# Altium project fmuvxX-baseT1.PrjPCB (part 2 of 3)

## Sheet 05_can_spi.SchDoc: =Proj_Title
size B; Date: 05/11/2022; CheckedBy: David Sidrane; Author: Dugan Yoon; Organization: © 2022 NXP; Address1: Giesshuebelstrasse 40; Address2: 8045 Zurich, Switzerland; DocumentNumber: 725001; Revision: 01; SheetNumber: 5; SheetTotal: 11
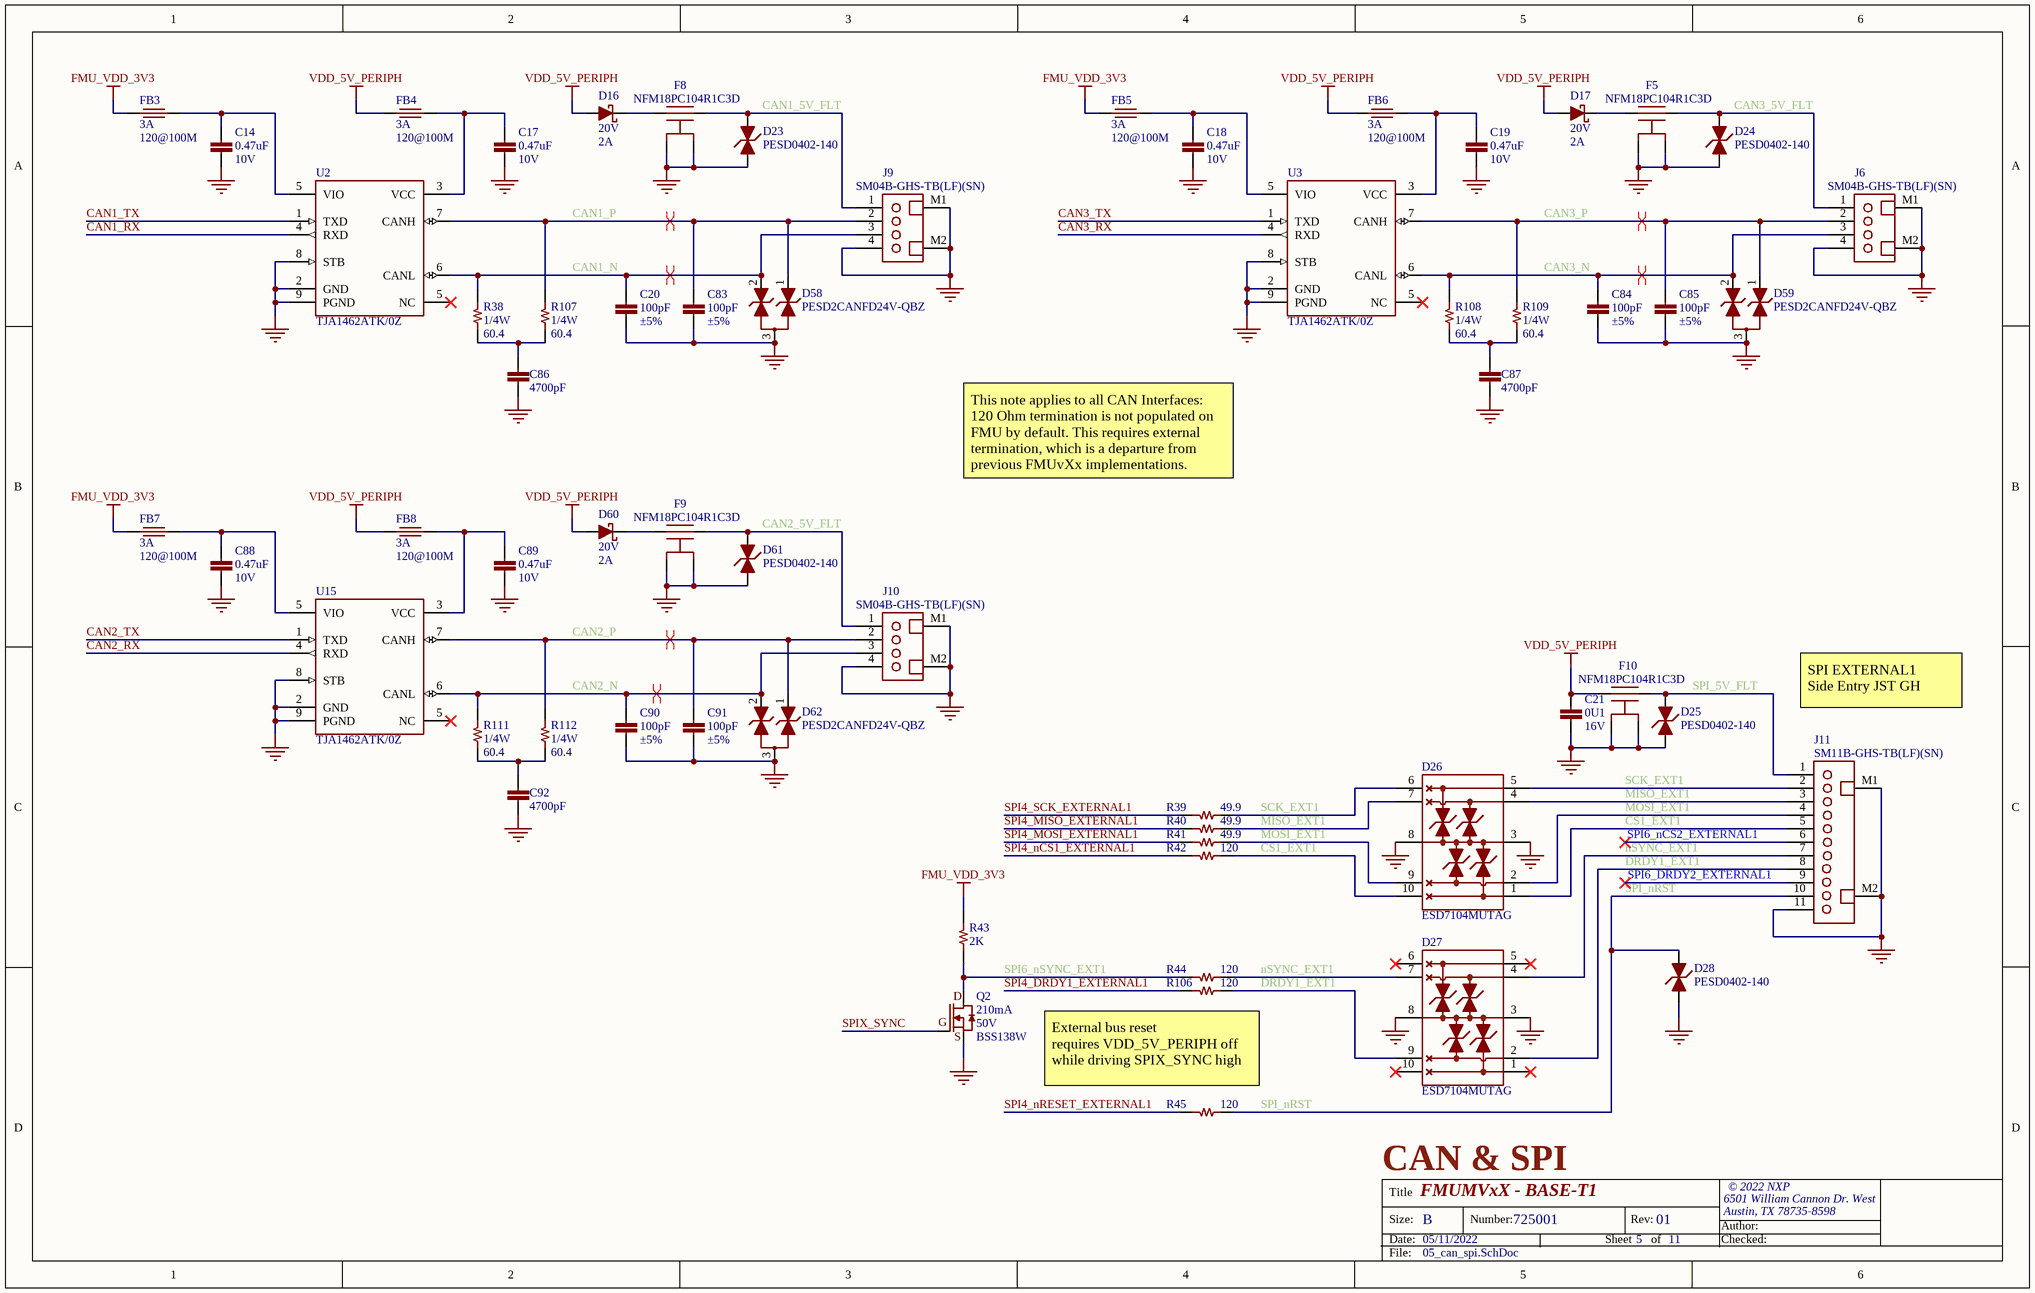
[diagram p3: 05_can_spi.SchDoc]

### Parts
C14  value 0.47uF  Voltage - Rated: 10V  [CAPC1608X90L30N]  (hidden comment: CAP CER 0.47UF 10% 10V X7R 0603)
C17  value 0.47uF  Voltage - Rated: 10V  [CAPC1608X90L30N]  (hidden comment: CAP CER 0.47UF 10% 10V X7R 0603)
C18  value 0.47uF  Voltage - Rated: 10V  [CAPC1608X90L30N]  (hidden comment: CAP CER 0.47UF 10% 10V X7R 0603)
C19  value 0.47uF  Voltage - Rated: 10V  [CAPC1608X90L30N]  (hidden comment: CAP CER 0.47UF 10% 10V X7R 0603)
C20  value 100pF  Tolerance: ±5%  [CAPC100X50X56L25N]  (hidden comment: CAP CER 100PF +/-5% 50V COG/NPO 0402)
C21  value 0U1  Voltage - Rated: 16V  [CAPC100X50X56L25N]  (hidden comment: CAP CER 0.1UF 10% 16V X7R 0402)
C83  value 100pF  Tolerance: ±5%  [CAPC100X50X56L25N]  (hidden comment: CAP CER 100PF +/-5% 50V COG/NPO 0402)
C84  value 100pF  Tolerance: ±5%  [CAPC100X50X56L25N]  (hidden comment: CAP CER 100PF +/-5% 50V COG/NPO 0402)
C85  value 100pF  Tolerance: ±5%  [CAPC100X50X56L25N]  (hidden comment: CAP CER 100PF +/-5% 50V COG/NPO 0402)
C86  value 4700pF  [CAPC100X50X56L25N]  (hidden comment: CAP CER 4700PF 10% 50V X7R 0402)
C87  value 4700pF  [CAPC100X50X56L25N]  (hidden comment: CAP CER 4700PF 10% 50V X7R 0402)
C88  value 0.47uF  Voltage - Rated: 10V  [CAPC1608X90L30N]  (hidden comment: CAP CER 0.47UF 10% 10V X7R 0603)
C89  value 0.47uF  Voltage - Rated: 10V  [CAPC1608X90L30N]  (hidden comment: CAP CER 0.47UF 10% 10V X7R 0603)
C90  value 100pF  Tolerance: ±5%  [CAPC100X50X56L25N]  (hidden comment: CAP CER 100PF +/-5% 50V COG/NPO 0402)
C91  value 100pF  Tolerance: ±5%  [CAPC100X50X56L25N]  (hidden comment: CAP CER 100PF +/-5% 50V COG/NPO 0402)
C92  value 4700pF  [CAPC100X50X56L25N]  (hidden comment: CAP CER 4700PF 10% 50V X7R 0402)
D16  Voltage: 20V  Current: 2A  [DIODFN2_160X80X40L34X71N]  (hidden comment: DIODE SCHOTTKY 20V 2A DFN1608D-2)
D17  Voltage: 20V  Current: 2A  [DIODFN2_160X80X40L34X71N]  (hidden comment: DIODE SCHOTTKY 20V 2A DFN1608D-2)
D23  Manufacturer Part Number: PESD0402-140  [DIONC100X50X43L20N]  (hidden comment: DIODE TVS BIDIRECTIONAL 14VWM 40VC 0402)
D24  Manufacturer Part Number: PESD0402-140  [DIONC100X50X43L20N]  (hidden comment: DIODE TVS BIDIRECTIONAL 14VWM 40VC 0402)
D25  Manufacturer Part Number: PESD0402-140  [DIONC100X50X43L20N]  (hidden comment: DIODE TVS BIDIRECTIONAL 14VWM 40VC 0402)
D26  Manufacturer Part Number: ESD7104MUTAG  [UDFN10P50_250X100X55L35X20N]  (hidden comment: DIODE TVS BIDIRECTIONAL 5V 10V 10UDFN)
D27  Manufacturer Part Number: ESD7104MUTAG  [UDFN10P50_250X100X55L35X20N]  (hidden comment: DIODE TVS BIDIRECTIONAL 5V 10V 10UDFN)
D28  Manufacturer Part Number: PESD0402-140  [DIONC100X50X43L20N]  (hidden comment: DIODE TVS BIDIRECTIONAL 14VWM 40VC 0402)
D58  Manufacturer Part Number: PESD2CANFD24V-QBZ  [NEXPERIA_SOT8015]  (hidden comment: DIODE TVS DUAL 42V CLAMP 2.6A (8/20us) DFN1110D-3)
D59  Manufacturer Part Number: PESD2CANFD24V-QBZ  [NEXPERIA_SOT8015]  (hidden comment: DIODE TVS DUAL 42V CLAMP 2.6A (8/20us) DFN1110D-3)
D60  Voltage: 20V  Current: 2A  [DIODFN2_160X80X40L34X71N]  (hidden comment: DIODE SCHOTTKY 20V 2A DFN1608D-2)
D61  Manufacturer Part Number: PESD0402-140  [DIONC100X50X43L20N]  (hidden comment: DIODE TVS BIDIRECTIONAL 14VWM 40VC 0402)
D62  Manufacturer Part Number: PESD2CANFD24V-QBZ  [NEXPERIA_SOT8015]  (hidden comment: DIODE TVS DUAL 42V CLAMP 2.6A (8/20us) DFN1110D-3)
F5  Manufacturer Part Number: NFM18PC104R1C3D  [NFM18PC104R1C3_0603_NO_VIA]  (hidden comment: FILTER CAP FEEDTHRU 0.1UF 20% 16V 0603)
F8  Manufacturer Part Number: NFM18PC104R1C3D  [NFM18PC104R1C3_0603_NO_VIA]  (hidden comment: FILTER CAP FEEDTHRU 0.1UF 20% 16V 0603)
F9  Manufacturer Part Number: NFM18PC104R1C3D  [NFM18PC104R1C3_0603_NO_VIA]  (hidden comment: FILTER CAP FEEDTHRU 0.1UF 20% 16V 0603)
F10  Manufacturer Part Number: NFM18PC104R1C3D  [NFM18PC104R1C3_0603_NO_VIA]  (hidden comment: FILTER CAP FEEDTHRU 0.1UF 20% 16V 0603)
FB3  value 120@100M  Current: 3A  [BEADC160X80X95L36N]  (hidden comment: IND FERRITE 120@100M 3A 20mOhm 0603)
FB4  value 120@100M  Current: 3A  [BEADC160X80X95L36N]  (hidden comment: IND FERRITE 120@100M 3A 20mOhm 0603)
FB5  value 120@100M  Current: 3A  [BEADC160X80X95L36N]  (hidden comment: IND FERRITE 120@100M 3A 20mOhm 0603)
FB6  value 120@100M  Current: 3A  [BEADC160X80X95L36N]  (hidden comment: IND FERRITE 120@100M 3A 20mOhm 0603)
FB7  value 120@100M  Current: 3A  [BEADC160X80X95L36N]  (hidden comment: IND FERRITE 120@100M 3A 20mOhm 0603)
FB8  value 120@100M  Current: 3A  [BEADC160X80X95L36N]  (hidden comment: IND FERRITE 120@100M 3A 20mOhm 0603)
J6  Manufacturer Part Number: SM04B-GHS-TB(LF)(SN)  [JST_SM04B-GHS-TBLFSN]  (hidden comment: CONN HEADER GH SIDE 4POS 1.25MM SMT)
J9  Manufacturer Part Number: SM04B-GHS-TB(LF)(SN)  [JST_SM04B-GHS-TBLFSN]  (hidden comment: CONN HEADER GH SIDE 4POS 1.25MM SMT)
J10  Manufacturer Part Number: SM04B-GHS-TB(LF)(SN)  [JST_SM04B-GHS-TBLFSN]  (hidden comment: CONN HEADER GH SIDE 4POS 1.25MM SMT)
J11  Manufacturer Part Number: SM11B-GHS-TB(LF)(SN)  [JST_SM11B-GHS-TBLFSN]  (hidden comment: CONN HEADER GH 11POS SIDE 1.25MM SMT)
Q2  Current: 210mA  Voltage: 50V  Manufacturer Part Number: BSS138W  [OnSemi_SC-70-3P65_210X110L20X32N]  (hidden comment: TRANSISTOR N-CH 50V .21A  SC-70)
R38  value 60.4  Power: 1/4W  [RESC1608X55L30N]  (hidden comment: RES 60.4 1% 1/4W 0603)
R39  value 49.9  [RESC100X50X40L25]  (hidden comment: RES SMD 49R9 OHM 1% 1/16W 0402)
R40  value 49.9  [RESC100X50X40L25]  (hidden comment: RES SMD 49R9 OHM 1% 1/16W 0402)
R41  value 49.9  [RESC100X50X40L25]  (hidden comment: RES SMD 49R9 OHM 1% 1/16W 0402)
R42  value 120  [RESC100X50X40L25]  (hidden comment: RES SMD 120 OHM 1% 1/16W 0402)
R43  value 2K  [RESC100X50X40L25]  (hidden comment: RES SMD 2K OHM 1% 1/16W 0402)
R44  value 120  [RESC100X50X40L25]  (hidden comment: RES SMD 120 OHM 1% 1/16W 0402)
R45  value 120  [RESC100X50X40L25]  (hidden comment: RES SMD 120 OHM 1% 1/16W 0402)
R106  value 120  [RESC100X50X40L25]  (hidden comment: RES SMD 120 OHM 1% 1/16W 0402)
R107  value 60.4  Power: 1/4W  [RESC1608X55L30N]  (hidden comment: RES 60.4 1% 1/4W 0603)
R108  value 60.4  Power: 1/4W  [RESC1608X55L30N]  (hidden comment: RES 60.4 1% 1/4W 0603)
R109  value 60.4  Power: 1/4W  [RESC1608X55L30N]  (hidden comment: RES 60.4 1% 1/4W 0603)
R111  value 60.4  Power: 1/4W  [RESC1608X55L30N]  (hidden comment: RES 60.4 1% 1/4W 0603)
R112  value 60.4  Power: 1/4W  [RESC1608X55L30N]  (hidden comment: RES 60.4 1% 1/4W 0603)
U2  Manufacturer Part Number: TJA1462ATK/0Z  [SON9P65_300X300X100L40X30T240X160_RECT_TABN]  (hidden comment: IC CAN TRANSCEIVER HALF 1/1 8-HVSON)
U3  Manufacturer Part Number: TJA1462ATK/0Z  [SON9P65_300X300X100L40X30T240X160_RECT_TABN]  (hidden comment: IC CAN TRANSCEIVER HALF 1/1 8-HVSON)
U15  Manufacturer Part Number: TJA1462ATK/0Z  [SON9P65_300X300X100L40X30T240X160_RECT_TABN]  (hidden comment: IC CAN TRANSCEIVER HALF 1/1 8-HVSON)

### Nets
FMU_VDD_3V3: FB3.1 FB5.1 FB7.1 R43.1
GND: C14.2 C17.2 C18.2 C19.2 C20.2 C21.2 C83.2 C84.2 C85.2 C86.2 C87.2 C88.2 C89.2 C90.2 C91.2 C92.2 D23.1 D24.1 D25.1 D26.3(GND) D26.8(GND) D27.3(GND) D27.8(GND) D28.1 D58.3 D59.3 D61.1 D62.3 F5.2A(GND) F5.2B(GND) F8.2A(GND) F8.2B(GND) F9.2A(GND) F9.2B(GND) F10.2A(GND) F10.2B(GND) J6.4 J6.M1 J6.M2 J9.4 J9.M1 J9.M2 J10.4 J10.M1 J10.M2 J11.11 J11.M1 J11.M2 Q2.S U2.2(GND) U2.8(STB) U2.9(PGND) U3.2(GND) U3.8(STB) U3.9(PGND) U15.2(GND) U15.8(STB) U15.9(PGND)
VDD_5V_PERIPH: C21.1 D16.A D17.A D60.A F10.1 FB4.1 FB6.1 FB8.1
CAN1_5V_FLT: D23.2 F8.3 J9.1
CAN1_N: C20.1 D58.2 J9.3 R38.1 U2.6(CANL)
CAN1_P: C83.1 D58.1 J9.2 R107.1 U2.7(CANH)
CAN1_RX: U2.4(RXD)
CAN1_TX: U2.1(TXD)
CAN2_5V_FLT: D61.2 F9.3 J10.1
CAN2_N: C90.1 D62.2 J10.3 R111.1 U15.6(CANL)
CAN2_P: C91.1 D62.1 J10.2 R112.1 U15.7(CANH)
CAN2_RX: U15.4(RXD)
CAN2_TX: U15.1(TXD)
CAN3_5V_FLT: D24.2 F5.3 J6.1
CAN3_N: C84.1 D59.2 J6.3 R108.1 U3.6(CANL)
CAN3_P: C85.1 D59.1 J6.2 R109.1 U3.7(CANH)
CAN3_RX: U3.4(RXD)
CAN3_TX: U3.1(TXD)
CS1_EXT1: D26.1 D26.10(NC) J11.5 R42.2
DRDY1_EXT1: D27.2 D27.9(NC) J11.8 R106.2
MISO_EXT1: D26.4 D26.7(NC) J11.3 R40.2
MOSI_EXT1: D26.2 D26.9(NC) J11.4 R41.2
nSYNC_EXT1: D27.4 D27.7(NC) J11.7 R44.2
SCK_EXT1: D26.5 D26.6(NC) J11.2 R39.2
SPI4_DRDY1_EXTERNAL1: R106.1
SPI4_MISO_EXTERNAL1: R40.1
SPI4_MOSI_EXTERNAL1: R41.1
SPI4_nCS1_EXTERNAL1: R42.1
SPI4_nRESET_EXTERNAL1: R45.1
SPI4_SCK_EXTERNAL1: R39.1
SPI6_nSYNC_EXT1: Q2.D R43.2 R44.1
SPI_5V_FLT: D25.2 F10.3 J11.1
SPI_nRST: D28.2 J11.10 R45.2
SPIX_SYNC: Q2.G
NetC14_1: C14.1 FB3.2 U2.5(VIO)
NetC17_1: C17.1 FB4.2 U2.3(VCC)
NetC18_1: C18.1 FB5.2 U3.5(VIO)
NetC19_1: C19.1 FB6.2 U3.3(VCC)
NetC86_1: C86.1 R38.2 R107.2
NetC87_1: C87.1 R108.2 R109.2
NetC88_1: C88.1 FB7.2 U15.5(VIO)
NetC89_1: C89.1 FB8.2 U15.3(VCC)
NetC92_1: C92.1 R111.2 R112.2
NetD16_C: D16.C F8.1
NetD17_C: D17.C F5.1
NetD60_C: D60.C F9.1

Not connected (* = marked no-connect by the designer): D27 1* 5* 6(NC)* 10(NC)*; J11 6* 9*

### Layout directives
differential pair: CAN1_N, CAN1_P, CAN2_N, CAN2_P, CAN3_N, CAN3_P

### Notes on the sheet
- This note applies to all CAN Interfaces:
  120 Ohm termination is not populated on FMU by default. This requires external termination, which is a departure from previous FMUvXx implementations.
- SPI EXTERNAL1
  Side Entry JST GH
- SPI6_nCS2_EXTERNAL1
- (near J11) SPI6_DRDY2_EXTERNAL1
- External bus reset
  requires VDD_5V_PERIPH off
  while driving SPIX_SYNC high
- CAN & SPI
- Title
- Size:
- Date:
- B
- Number:
- Sheet
- Rev:
- of
- Author:
- Checked:
- File:

### Library data of the parts
C14 C17-C19 C88 C89 = CAP_0U47_10V_X7R_0603: Manufacturer: Samsung Electro-Mechanics; Manufacturer Part Number: CL10B474KP8NNNC; Packaging: Cut Tape (CT); Part Status: Active; Tolerance: ±10%; Operating Temperature: -55°C ~ 125°C; Supplier 1: Digi-Key; Supplier Part Number 1: 1276-1247-1-ND; Category: Capacitors; Stock 1: 40000; Pricing 1: 1=0.1, 10=0.065, 100=0.0292, 500=0.02082, 1000=0.01637, 2500=0.01488, 5000=0.01369 (USD); ComponentLink1Description: https://www.digikey.com/product-detail/en/samsung-electro-mechanics/CL10B474KP8NNNC/1276-1247-1-ND/3889333; ComponentLink1URL: https://www.digikey.com/product-detail/en/samsung-electro-mechanics/CL10B474KP8NNNC/1276-1247-1-ND/3889333
C20 C83-C85 C90 C91 = CAP_100PF_50V_COG/NPO_0402: Manufacturer: Murata Electronics; Manufacturer Part Number: GRM1555C1H101JA01D; Packaging: Tape & Reel (TR); Part Status: Active; Operating Temperature: -55°C ~ 125°C; Supplier 1: Digi-Key; Supplier Part Number 1: 490-5922-1-ND; Category: Capacitors; Stock 1: 11490608; Pricing 1: 1=0.1 (USD); Voltage - Rated: 50V; ComponentLink1Description: https://www.digikey.com/en/products/detail/murata-electronics/GRM1555C1H101JA01D/3721279; ComponentLink1URL: https://www.digikey.com/en/products/detail/murata-electronics/GRM1555C1H101JA01D/3721279
C21 = CAP_0U1_16V_X7R_0402: Manufacturer: Murata Electronics; Manufacturer Part Number: GCM155R71C104KA55J; Packaging: Cut Tape (CT); Part Status: Active; Tolerance: ±10%; Operating Temperature: -55°C ~ 125°C; Supplier 1: Digi-Key; Supplier Part Number 1: 490-7998-1-ND; Category: Capacitors; Stock 1: 6381653; Pricing 1: 1=0.1, 10=0.049, 100=0.022, 500=0.0157, 1000=0.01233, 2500=0.01121, 5000=0.01032 (USD); ComponentLink1Description: https://www.digikey.com/product-detail/en/murata-electronics/GCM155R71C104KA55J/490-7998-1-ND/4380283; ComponentLink1URL: https://www.digikey.com/product-detail/en/murata-electronics/GCM155R71C104KA55J/490-7998-1-ND/4380283
C86 C87 C92 = CAP_4700PF_5%_50V_X7R_0402: Manufacturer: Murata Electronics; Manufacturer Part Number: GRM155R71H472KA01J; Packaging: Cut Tape (CT); Part Status: Active; Temperature Coefficient: X7R; Operating Temperature: -55°C ~ 125°C; Ratings: -; Supplier 1: Digi-Key; Supplier Part Number 1: 490-8259-1-ND; Category: Capacitors; Stock 1: 457897; Pricing 1: 1=0.1, 10=0.011, 100=0.005, 500=0.00354, 1000=0.00278, 2500=0.00253, 5000=0.00233 (USD); Voltage - Rated: 50V; ComponentLink1Description: https://www.digikey.com/en/products/detail/murata-electronics/GRM155R71H472KA01J/2610945; ComponentLink1URL: https://www.digikey.com/en/products/detail/murata-electronics/GRM155R71H472KA01J/2610945; Tolerance: ±10%
D16 D17 D60 = DIODE_SCHOTTKY_20V_2A_DFN1608D-2: Manufacturer: Nexperia USA Inc.; Manufacturer Part Number: PMEG2020EPK,315; Packaging: Cut Tape (CT); Part Status: Active; Supplier 1: Digi-Key; Supplier Part Number 1: 1727-1338-1-ND; Category: Discrete Semiconductor Products; Stock 1: 0; Pricing 1: 1=0.51 (USD); ComponentLink1Description: https://www.digikey.com/en/products/detail/nexperia-usa-inc/PMEG2020EPK-315/4020972; ComponentLink1URL: https://www.digikey.com/en/products/detail/nexperia-usa-inc/PMEG2020EPK-315/4020972
D23-D25 D28 D61 = DIODE_TVS_0402: Manufacturer: Littelfuse Inc.; Packaging: Cut Tape (CT); Part Status: Active; Operating Temperature: -55°C ~ 125°C (TJ); ComponentLink1URL: https://www.digikey.com/products/en/circuit-protection/tvs-diodes/144?k=PESD0402-140&k=&pkeyword=PESD0402-140&pv7=2&sf=0&quantity=&ColumnSort=0&page=1&pageSize=25; ComponentLink1Description: https://www.digikey.com/products/en/circuit-protection/tvs-diodes/144?k=PESD0402-140&k=&pkeyword=PESD0402-140&pv7=2&sf=0&quantity=&ColumnSort=0&page=1&pageSize=25; Supplier 1: Digi-Key; Supplier Part Number 1: PESD0402-140CT-ND; Category: Circuit Protection; Stock 1: 281442; Pricing 1: 10000=0.13154, 30000=0.12096 (USD)
D26 D27 = DIODE_TVS_4X_10UDFN: Manufacturer: ON Semiconductor; Packaging: Cut Tape (CT); Part Status: Active; Operating Temperature: -55°C ~ 125°C (TJ); Supplier 1: Digi-Key; Supplier Part Number 1: ESD7104MUTAGOSCT-ND; Category: Circuit Protection; Stock 1: 5750; Pricing 1: 1=0.63, 10=0.541, 100=0.40370, 500=0.31716, 1000=0.24508 (USD); ComponentLink1Description: https://www.digikey.com/product-detail/en/on-semiconductor/ESD7104MUTAG/ESD7104MUTAGOSCT-ND/3487538; ComponentLink1URL: https://www.digikey.com/product-detail/en/on-semiconductor/ESD7104MUTAG/ESD7104MUTAGOSCT-ND/3487538
D58 D59 D62 = DIODE_TVS_DUAL_24VWM_42VC_DFN1110D-3: Manufacturer: Nexperia USA Inc.; Packaging: Cut Tape (CT); Part Status: Active; Supplier 1: Digi-Key; Supplier Part Number 1: 1727-PESD2CANFD24V-QBZCT-ND; Category: Discrete Semiconductor Products; Stock 1: 11955; Pricing 1: 1=0.44 (USD); Current: 2.6A; Voltage: 42V; ComponentLink1Description: https://www.digikey.com/en/products/detail/nexperia-usa-inc/PESD2CANFD24V-QBZ/13898295?s=N4IgTCBcDaIAoFEDKARMBhAggOQGJoBYA1AWgEUAhEAXQF8g; ComponentLink1URL: https://www.digikey.com/en/products/detail/nexperia-usa-inc/PESD2CANFD24V-QBZ/13898295?s=N4IgTCBcDaIAoFEDKARMBhAggOQGJoBYA1AWgEUAhEAXQF8g
F5 F8-F10 = FILTER_0.1uF_16V_2A_NO_VIA_0603: Manufacturer: Murata Electronics North America; Packaging: Cut Tape (CT); Part Status: Active; Tolerance: ±20%; Voltage - Rated: 16V; Operating Temperature: -55°C ~ 125°C; Supplier 1: Digi-Key; Supplier Part Number 1: 490-6969-1-ND; Category: Filters; Stock 1: 172860; Pricing 1: 1=0.19, 10=0.173, 25=0.1652, 50=0.1598, 100=0.1544, 250=0.1464, 500=0.12246, 1000=0.09503 (USD); ComponentLink1Description: https://www.digikey.com/products/en/filters/feed-through-capacitors/845?k=NFM18PC104R1C3D&k=&pkeyword=NFM18PC104R1C3D&pv7=2&sf=0&quantity=&ColumnSort=0&page=1&pageSize=25; ComponentLink1URL: https://www.digikey.com/products/en/filters/feed-through-capacitors/845?k=NFM18PC104R1C3D&k=&pkeyword=NFM18PC104R1C3D&pv7=2&sf=0&quantity=&ColumnSort=0&page=1&pageSize=25
FB3-FB8 = IND_FERRITE_120@100M_3A_0603: Manufacturer: Murata Electronics; Manufacturer Part Number: BLM18KG121TZ1D; Packaging: Cut Tape (CT); Part Status: Active; Operating Temperature: -55°C ~ 125°C; Supplier 1: Digi-Key; Supplier Part Number 1: 490-16500-1-ND; Category: Inductors; Stock 1: 0; Pricing 1: 1=0.11 (USD); ComponentLink1Description: https://www.digikey.com/en/products/detail/murata-electronics/BLM18KG121TZ1D/7363244?s=N4IgTCBcDaIEYBsC2BGAHAawOYrCgLgF4ogC6AvkA; ComponentLink1URL: https://www.digikey.com/en/products/detail/murata-electronics/BLM18KG121TZ1D/7363244?s=N4IgTCBcDaIEYBsC2BGAHAawOYrCgLgF4ogC6AvkA
J6 J9 J10 = CONN_JST_GH_4PIN_RA_SMT: Manufacturer: JST Sales America Inc.; Voltage Rating: 50V; System: Connector; Packaging: Cut Tape (CT); Part Status: Active; Operating Temperature: -25°C ~ 85°C; Supplier 1: Digi-Key; Supplier Part Number 1: 455-1566-1-ND; Category: Connectors, Interconnects; Stock 1: 109892; Pricing 1: 1=0.45, 10=0.423, 100=0.3244, 500=0.28212, 1000=0.23274 (USD); ComponentLink1Description: https://www.digikey.com/products/en/connectors-interconnects/rectangular-connectors-headers-male-pins/314?k=SM04B-GHS-TB%28LF%29%28SN%29-&k=&pkeyword=SM04B-GHS-TB%28LF%29%28SN%29-&pv7=2&sf=0&quantity=&ColumnSort=0&page=1&pageSize=25; ComponentLink1URL: https://www.digikey.com/products/en/connectors-interconnects/rectangular-connectors-headers-male-pins/314?k=SM04B-GHS-TB%28LF%29%28SN%29-&k=&pkeyword=SM04B-GHS-TB%28LF%29%28SN%29-&pv7=2&sf=0&quantity=&ColumnSort=0&page=1&pageSize=25
J11 = CONN_JST_GH_11PIN_RA_SMT: Manufacturer: JST Sales America Inc.; Voltage - Rated: 50V; System: Connector; Packaging: Cut Tape (CT); Part Status: Active; Operating Temperature: -25°C ~ 85°C; Supplier 1: Digi-Key; Supplier Part Number 1: 455-1573-1-ND; Category: Connectors, Interconnects; Stock 1: 659; Pricing 1: 1=0.67, 10=0.631, 100=0.4838, 500=0.42068, 1000=0.34705 (USD); ComponentLink1Description: https://www.digikey.com/products/en/connectors-interconnects/rectangular-connectors-headers-male-pins/314?k=sm11b-ghs&k=&pkeyword=sm11b-ghs&pv7=2&sf=0&quantity=&ColumnSort=0&page=1&pageSize=25; ComponentLink1URL: https://www.digikey.com/products/en/connectors-interconnects/rectangular-connectors-headers-male-pins/314?k=sm11b-ghs&k=&pkeyword=sm11b-ghs&pv7=2&sf=0&quantity=&ColumnSort=0&page=1&pageSize=25
Q2 = TRAN_MOSFET_N-CH_BSS138W_SMT: Manufacturer: ON Semiconductor; Packaging: Cut Tape (CT); Part Status: Active; Supplier 1: Digi-Key; Supplier Part Number 1: BSS138WCT-ND; Category: Discrete Semiconductor Products; Stock 1: 2599; Pricing 1: 1=0.43 (USD); ComponentLink1Description: https://www.digikey.com/product-detail/en/on-semiconductor/BSS138W/BSS138WCT-ND/3907886; ComponentLink1URL: https://www.digikey.com/product-detail/en/on-semiconductor/BSS138W/BSS138WCT-ND/3907886
R38 R107-R109 R111 R112 = RES_60.4_1%_1/4W_0603: Manufacturer: Vishay Dale; Manufacturer Part Number: RCS060360R4FKEA; Packaging: Digi-Reel®; Part Status: Active; Tolerance: ±1%; Operating Temperature: -55°C ~ 155°C; Supplier 1: Digi-Key; Supplier Part Number 1: 541-10484-1-ND; Category: Resistors; Stock 1: 6966; Pricing 1: 1=0.15 (USD); ComponentLink1Description: https://www.digikey.com/en/products/detail/vishay-dale/RCS060360R4FKEA/5868350; ComponentLink1URL: https://www.digikey.com/en/products/detail/vishay-dale/RCS060360R4FKEA/5868350
R39-R41 = RES_49.9_1%_1/16W_0402: Manufacturer: Yageo; Manufacturer Part Number: RC0402FR-0749R9L; Packaging: Cut Tape (CT); Part Status: Active; Tolerance: ±1%; Operating Temperature: -55°C ~ 155°C; Supplier 1: Digi-Key; Supplier Part Number 1: 311-49.9LRCT-ND; Category: Resistors; Stock 1: 21141499; Pricing 1: 1=0.1, 10=0.014, 100=0.0056, 1000=0.00253, 2500=0.0022, 5000=0.00181 (USD); Power: 1/16W; ComponentLink1Description: https://www.digikey.com/product-detail/en/yageo/RC0402FR-0749R9L/311-49.9LRCT-ND/729568; ComponentLink1URL: https://www.digikey.com/product-detail/en/yageo/RC0402FR-0749R9L/311-49.9LRCT-ND/729568
R42 R44 R45 R106 = RES_120_1%_1/16W_0402: Manufacturer: Yageo; Manufacturer Part Number: RC0402FR-07120RL; Category: Resistors; Packaging: Cut Tape (CT); Part Status: Active; Tolerance: ±1%; Operating Temperature: -55°C ~ 155°C; Supplier 1: Digi-Key; Supplier Part Number 1: 311-120LRCT-ND; Stock 1: 607269; Pricing 1: 1=0.1, 10=0.014, 100=0.0056, 1000=0.00253, 2500=0.0022, 5000=0.00181 (USD); Power: 1/16W; ComponentLink1Description: https://www.digikey.com/products/en/resistors/chip-resistor-surface-mount/52?k=RC0402FR-07120RL&k=&pkeyword=RC0402FR-07120RL&pv7=2&sf=0&quantity=&ColumnSort=0&page=1&pageSize=25; ComponentLink1URL: https://www.digikey.com/products/en/resistors/chip-resistor-surface-mount/52?k=RC0402FR-07120RL&k=&pkeyword=RC0402FR-07120RL&pv7=2&sf=0&quantity=&ColumnSort=0&page=1&pageSize=25
R43 = RES_2K_1%_1/16W_0402: Manufacturer: Yageo; Manufacturer Part Number: RC0402FR-072KL; Packaging: Cut Tape (CT); Part Status: Active; Tolerance: ±1%; Operating Temperature: -55°C ~ 155°C; Supplier 1: Digi-Key; Supplier Part Number 1: 311-2KLRCT-ND; Category: Resistors; Stock 1: 18685853; Pricing 1: 1=0.1, 10=0.014, 100=0.0056, 1000=0.00253, 2500=0.0022, 5000=0.00181 (USD); Power: 1/16W; ComponentLink1Description: https://www.digikey.com/product-detail/en/yageo/RC0402FR-072KL/311-2KLRCT-ND/2827883; ComponentLink1URL: https://www.digikey.com/product-detail/en/yageo/RC0402FR-072KL/311-2KLRCT-ND/2827883
U2 U3 U15 = IC_TJA1462ATK/0Z_8-HVSON: Manufacturer: NXP USA Inc.; Packaging: Tape & Reel (TR); Part Status: Active; Operating Temperature: -40°C ~ 150°C; Supplier 1: Digi-Key; Supplier Part Number 1: 568-TJA1462ATK/0ZCT-ND; Category: Integrated Circuits (ICs); Stock 1: 0; Pricing 1: 1=1.57 (USD); ComponentLink1Description: https://www.digikey.com/en/products/detail/nxp-usa-inc/TJA1462ATK-0Z/13590298?s=N4IgTCBcDaICoCkCCBGALANjEuBpA9AAwBaIAugL5A; ComponentLink1URL: https://www.digikey.com/en/products/detail/nxp-usa-inc/TJA1462ATK-0Z/13590298?s=N4IgTCBcDaICoCkCCBGALANjEuBpA9AAwBaIAugL5A

## Sheet 08_power.SchDoc: =Proj_Title
size B; Date: 05/11/2022; CheckedBy: David Sidrane; Author: Dugan Yoon; Organization: © 2022 NXP; Address1: Giesshuebelstrasse 40; Address2: 8045 Zurich, Switzerland; DocumentNumber: 725001; Revision: 01; SheetNumber: 8; SheetTotal: 11
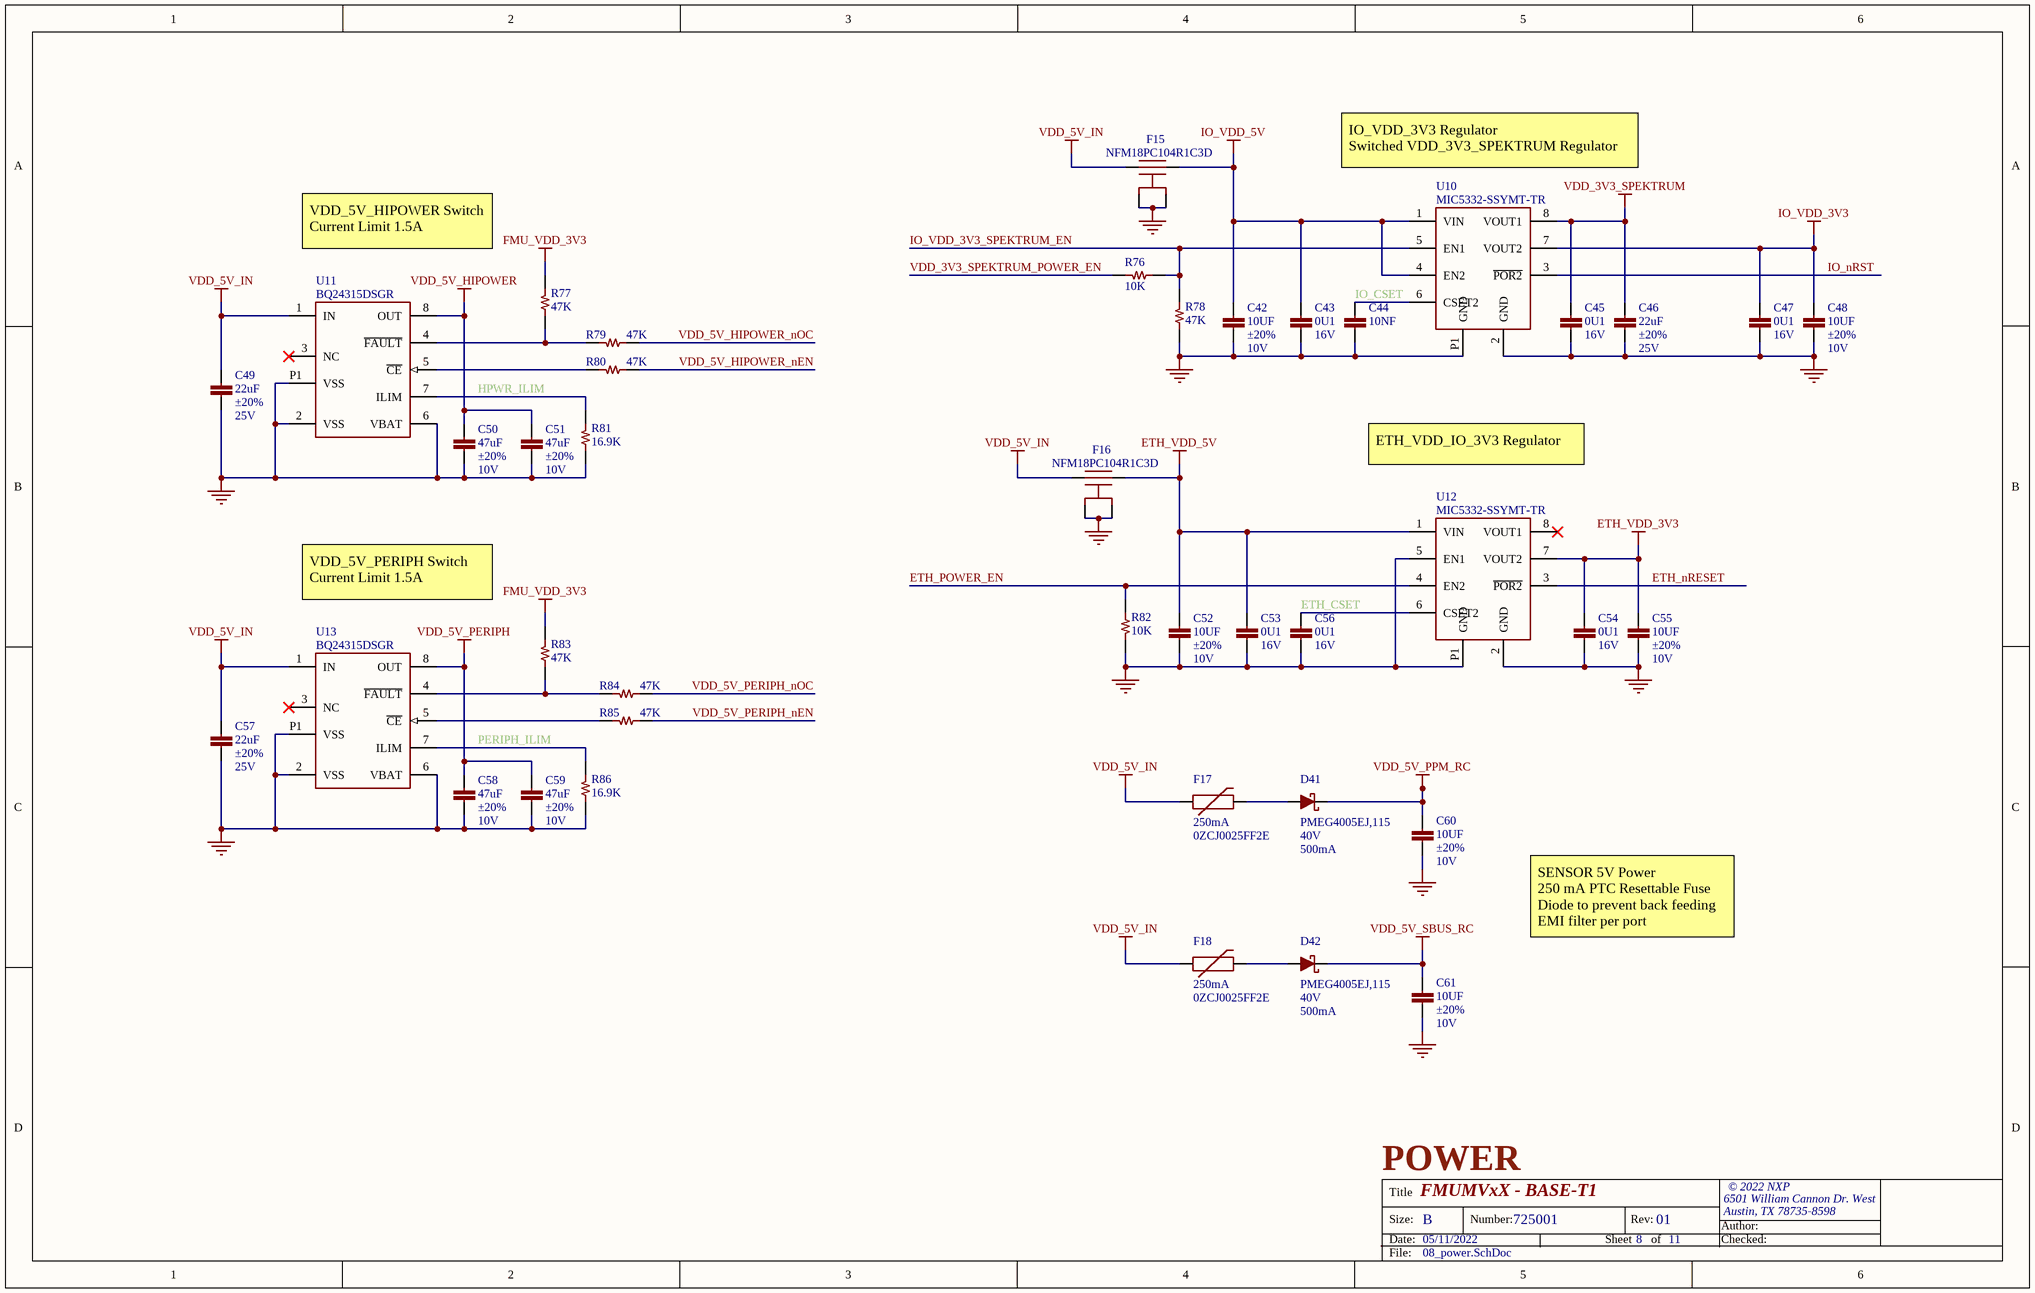
[diagram p4: 08_power.SchDoc]

### Parts
C42  value 10UF  Tolerance: ±20%  Voltage - Rated: 10V  [CAPC100X50X56L25N]  (hidden comment: CAP CER 10UF 20% 10V X5R 0402)
C43  value 0U1  Voltage - Rated: 16V  [CAPC100X50X56L25N]  (hidden comment: CAP CER 0.1UF 10% 16V X7R 0402)
C44  value 10NF  [CAPC100X50X56L25N]  (hidden comment: CAP CER 10NF 10% 50V X7R 0402)
C45  value 0U1  Voltage - Rated: 16V  [CAPC100X50X56L25N]  (hidden comment: CAP CER 0.1UF 10% 16V X7R 0402)
C46  value 22uF  Tolerance: ±20%  Voltage - Rated: 25V  [CAPC200X125X70L40N]  (hidden comment: CAP CER 22UF 20% 25V X5R 0805)
C47  value 0U1  Voltage - Rated: 16V  [CAPC100X50X56L25N]  (hidden comment: CAP CER 0.1UF 10% 16V X7R 0402)
C48  value 10UF  Tolerance: ±20%  Voltage - Rated: 10V  [CAPC100X50X56L25N]  (hidden comment: CAP CER 10UF 20% 10V X5R 0402)
C49  value 22uF  Tolerance: ±20%  Voltage - Rated: 25V  [CAPC200X125X70L40N]  (hidden comment: CAP CER 22UF 20% 25V X5R 0805)
C50  value 47uF  Tolerance: ±20%  Voltage - Rated: 10V  [CAPC200X125X145L45N]  (hidden comment: CAP CER 47UF 20% 10V X5R 0805)
C51  value 47uF  Tolerance: ±20%  Voltage - Rated: 10V  [CAPC200X125X145L45N]  (hidden comment: CAP CER 47UF 20% 10V X5R 0805)
C52  value 10UF  Tolerance: ±20%  Voltage - Rated: 10V  [CAPC100X50X56L25N]  (hidden comment: CAP CER 10UF 20% 10V X5R 0402)
C53  value 0U1  Voltage - Rated: 16V  [CAPC100X50X56L25N]  (hidden comment: CAP CER 0.1UF 10% 16V X7R 0402)
C54  value 0U1  Voltage - Rated: 16V  [CAPC100X50X56L25N]  (hidden comment: CAP CER 0.1UF 10% 16V X7R 0402)
C55  value 10UF  Tolerance: ±20%  Voltage - Rated: 10V  [CAPC100X50X56L25N]  (hidden comment: CAP CER 10UF 20% 10V X5R 0402)
C56  value 0U1  Voltage - Rated: 16V  [CAPC100X50X56L25N]  (hidden comment: CAP CER 0.1UF 10% 16V X7R 0402)
C57  value 22uF  Tolerance: ±20%  Voltage - Rated: 25V  [CAPC200X125X70L40N]  (hidden comment: CAP CER 22UF 20% 25V X5R 0805)
C58  value 47uF  Tolerance: ±20%  Voltage - Rated: 10V  [CAPC200X125X145L45N]  (hidden comment: CAP CER 47UF 20% 10V X5R 0805)
C59  value 47uF  Tolerance: ±20%  Voltage - Rated: 10V  [CAPC200X125X145L45N]  (hidden comment: CAP CER 47UF 20% 10V X5R 0805)
C60  value 10UF  Tolerance: ±20%  Voltage - Rated: 10V  [CAPC100X50X56L25N]  (hidden comment: CAP CER 10UF 20% 10V X5R 0402)
C61  value 10UF  Tolerance: ±20%  Voltage - Rated: 10V  [CAPC100X50X56L25N]  (hidden comment: CAP CER 10UF 20% 10V X5R 0402)
D41  Manufacturer Part Number: PMEG4005EJ,115  Voltage: 40V  Current: 500mA  [SODFL2512X80L40X35N]  (hidden comment: DIODE SCHOTTKY 40V 500MA SOD323F)
D42  Manufacturer Part Number: PMEG4005EJ,115  Voltage: 40V  Current: 500mA  [SODFL2512X80L40X35N]  (hidden comment: DIODE SCHOTTKY 40V 500MA SOD323F)
F15  Manufacturer Part Number: NFM18PC104R1C3D  [NFM18PC104R1C3_0603_NO_VIA]  (hidden comment: FILTER CAP FEEDTHRU 0.1UF 20% 16V 0603)
F16  Manufacturer Part Number: NFM18PC104R1C3D  [NFM18PC104R1C3_0603_NO_VIA]  (hidden comment: FILTER CAP FEEDTHRU 0.1UF 20% 16V 0603)
F17  Current Hold: 250mA  Manufacturer Part Number: 0ZCJ0025FF2E  [PTC-1206]  (hidden comment: FUSE PTC RESETTABLE 250MA 16V 1206)
F18  Current Hold: 250mA  Manufacturer Part Number: 0ZCJ0025FF2E  [PTC-1206]  (hidden comment: FUSE PTC RESETTABLE 250MA 16V 1206)
R76  value 10K  [RESC100X50X40L25]  (hidden comment: RES SMD 10K OHM 1% 1/16W 0402)
R77  value 47K  [RESC100X50X40L25]  (hidden comment: RES SMD 47K OHM 1% 1/16W 0402)
R78  value 47K  [RESC100X50X40L25]  (hidden comment: RES SMD 47K OHM 1% 1/16W 0402)
R79  value 47K  [RESC100X50X40L25]  (hidden comment: RES SMD 47K OHM 1% 1/16W 0402)
R80  value 47K  [RESC100X50X40L25]  (hidden comment: RES SMD 47K OHM 1% 1/16W 0402)
R81  value 16.9K  [RESC100X50X40L25]  (hidden comment: RES SMD 16.9K OHM 1% 1/16W 0402)
R82  value 10K  [RESC100X50X40L25]  (hidden comment: RES SMD 10K OHM 1% 1/16W 0402)
R83  value 47K  [RESC100X50X40L25]  (hidden comment: RES SMD 47K OHM 1% 1/16W 0402)
R84  value 47K  [RESC100X50X40L25]  (hidden comment: RES SMD 47K OHM 1% 1/16W 0402)
R85  value 47K  [RESC100X50X40L25]  (hidden comment: RES SMD 47K OHM 1% 1/16W 0402)
R86  value 16.9K  [RESC100X50X40L25]  (hidden comment: RES SMD 16.9K OHM 1% 1/16W 0402)
U10  Manufacturer Part Number: MIC5332-SSYMT-TR  [SON9P50_200X200X60L35X25T120X60N]  (hidden comment: IC REG LIN 3.3V/3.3V 8TMLF)
U11  Manufacturer Part Number: BQ24315DSGR  [SON9P50_200X200X80L30X25T160X80N]  (hidden comment: IC LI+ CHARGER FRONT END 8SON)
U12  Manufacturer Part Number: MIC5332-SSYMT-TR  [SON9P50_200X200X60L35X25T120X60N]  (hidden comment: IC REG LIN 3.3V/3.3V 8TMLF)
U13  Manufacturer Part Number: BQ24315DSGR  [SON9P50_200X200X80L30X25T160X80N]  (hidden comment: IC LI+ CHARGER FRONT END 8SON)

### Nets
ETH_VDD_3V3: C54.1 C55.1 U12.7(VOUT2)
ETH_VDD_5V: C52.1 C53.1 F16.3 U12.1(VIN)
FMU_VDD_3V3: R77.1 R83.1
GND: C42.2 C43.2 C44.2 C45.2 C46.2 C47.2 C48.2 C49.2 C50.2 C51.2 C52.2 C53.2 C54.2 C55.2 C56.2 C57.2 C58.2 C59.2 C60.2 C61.2 F15.2A(GND) F15.2B(GND) F16.2A(GND) F16.2B(GND) R78.2 R81.2 R82.1 R86.2 U10.2(GND) U10.P1(GND) U11.2(VSS) U11.6(VBAT) U11.P1(VSS) U12.2(GND) U12.5(EN1) U12.P1(GND) U13.2(VSS) U13.6(VBAT) U13.P1(VSS)
IO_VDD_3V3: C47.1 C48.1 U10.7(VOUT2)
IO_VDD_5V: C42.1 C43.1 F15.3 U10.1(VIN) U10.4(EN2)
VDD_3V3_SPEKTRUM: C45.1 C46.1 U10.8(VOUT1)
VDD_5V_HIPOWER: C50.1 C51.1 U11.8(OUT)
VDD_5V_IN: C49.1 C57.1 F15.1 F16.1 F17.1 F18.1 U11.1(IN) U13.1(IN)
VDD_5V_PERIPH: C58.1 C59.1 U13.8(OUT)
VDD_5V_PPM_RC: C60.1 D41.C
VDD_5V_SBUS_RC: C61.1 D42.C
ETH_CSET: C56.1 U12.6(CSET2)
ETH_nRESET: U12.3(~{POR2})
ETH_POWER_EN: R82.2 U12.4(EN2)
HPWR_ILIM: R81.1 U11.7(ILIM)
IO_CSET: C44.1 U10.6(CSET2)
IO_nRST: U10.3(~{POR2})
IO_VDD_3V3_SPEKTRUM_EN: R76.2 R78.1 U10.5(EN1)
PERIPH_ILIM: R86.1 U13.7(ILIM)
VDD_3V3_SPEKTRUM_POWER_EN: R76.1
VDD_5V_HIPOWER_nEN: R80.2
VDD_5V_HIPOWER_nOC: R79.2
VDD_5V_PERIPH_nEN: R85.2
VDD_5V_PERIPH_nOC: R84.2
NetD41_A: D41.A F17.2
NetD42_A: D42.A F18.2
NetR77_2: R77.2 R79.1 U11.4(~{FAULT})
NetR80_1: R80.1 U11.5(~{CE})
NetR83_2: R83.2 R84.1 U13.4(~{FAULT})
NetR85_1: R85.1 U13.5(~{CE})

Not connected (* = marked no-connect by the designer): U11 3(NC)*; U12 8(VOUT1)*; U13 3(NC)*

### Notes on the sheet
- IO_VDD_3V3 Regulator
  Switched VDD_3V3_SPEKTRUM Regulator
- VDD_5V_HIPOWER Switch
  Current Limit 1.5A
- ETH_VDD_IO_3V3 Regulator
- VDD_5V_PERIPH Switch
  Current Limit 1.5A
- SENSOR 5V Power
  250 mA PTC Resettable Fuse
  Diode to prevent back feeding
  EMI filter per port
- POWER
- Title
- Size:
- Date:
- B
- Number:
- Sheet
- Rev:
- of
- Author:
- Checked:
- File:

### Library data of the parts
C42 C48 C52 C55 C60 C61 = CAP_10UF_20%_10V_X5R_0402: Manufacturer: Samsung Electro-Mechanics; Manufacturer Part Number: CL05A106MP5NUNC; Packaging: Tape & Reel (TR); Part Status: Active; Temperature Coefficient: X5R; Operating Temperature: -55°C ~ 85°C; Ratings: -; Supplier 1: Digi-Key; Supplier Part Number 1: 1276-1450-1-ND; Category: Capacitors; Stock 1: 0; Pricing 1: 1=0.53, 10=0.373, 100=0.23, 500=0.1761, 1000=0.15094, 2500=0.14375, 5000=0.13656 (USD); ComponentLink1Description: https://www.digikey.com/products/en?keywords=%091276-1450-1-ND; ComponentLink1URL: https://www.digikey.com/products/en?keywords=%091276-1450-1-ND
C43 C45 C47 C53 C54 C56 = CAP_0U1_16V_X7R_0402: as C21 on sheet 05_can_spi; Packaging: Cut Tape (CT); Part Status: Active; Tolerance: ±10%; Operating Temperature: -55°C ~ 125°C; Supplier 1: Digi-Key; Supplier Part Number 1: 490-7998-1-ND; Category: Capacitors; Stock 1: 6381653; Pricing 1: 1=0.1, 10=0.049, 100=0.022, 500=0.0157, 1000=0.01233, 2500=0.01121, 5000=0.01032 (USD); ComponentLink1Description: https://www.digikey.com/product-detail/en/murata-electronics/GCM155R71C104KA55J/490-7998-1-ND/4380283; ComponentLink1URL: https://www.digikey.com/product-detail/en/murata-electronics/GCM155R71C104KA55J/490-7998-1-ND/4380283
C44 = CAP_10NF_10%_50V_X7R_0402: Manufacturer: Murata Electronics North America; Manufacturer Part Number: GRM155R71H103KA88D; Voltage - Rated: 50V; Packaging: Cut Tape (CT); Part Status: Active; Tolerance: ±10%; Temperature Coefficient: X7R; Operating Temperature: -55°C ~ 125°C; Ratings: -; Supplier 1: Digi-Key; Supplier Part Number 1: 490-4516-1-ND; Category: Capacitors; Stock 1: 10174125; Pricing 1: 1=0.1, 10=0.011, 100=0.005, 500=0.00354, 1000=0.00278, 2500=0.00253, 5000=0.00233 (USD); ComponentLink1Description: https://www.digikey.com/products/en/capacitors/ceramic-capacitors/60?k=GRM155R71H103KA88D&k=&pkeyword=GRM155R71H103KA88D&pv7=2&sf=0&quantity=&ColumnSort=0&page=1&pageSize=25; ComponentLink1URL: https://www.digikey.com/products/en/capacitors/ceramic-capacitors/60?k=GRM155R71H103KA88D&k=&pkeyword=GRM155R71H103KA88D&pv7=2&sf=0&quantity=&ColumnSort=0&page=1&pageSize=25
C46 C49 C57 = CAP_22UF_20%_25V_X5R_0805: Manufacturer: Murata Electronics; Manufacturer Part Number: GRT21BR61E226ME13L; Packaging: Cut Tape (CT); Part Status: Active; Operating Temperature: -55°C ~ 125°C; Supplier 1: Digi-Key; Supplier Part Number 1: 490-12389-1-ND; Category: Capacitors; Stock 1: 0; Pricing 1: 1=0.58 (USD); ComponentLink1Description: https://www.digikey.com/en/products/detail/murata-electronics/GRT21BR61E226ME13L/5416811; ComponentLink1URL: https://www.digikey.com/en/products/detail/murata-electronics/GRT21BR61E226ME13L/5416811
C50 C51 C58 C59 = CAP_47UF_20%_10V_X5R_0805: Manufacturer: Murata Electronics North America; Manufacturer Part Number: GRM21BR61A476ME15L; Packaging: Cut Tape (CT); Part Status: Active; Operating Temperature: -55°C ~ 85°C; Supplier 1: Digi-Key; Supplier Part Number 1: 490-9961-1-ND; Category: Capacitors; Stock 1: 4315932; Pricing 1: 1=0.75 (USD); ComponentLink1Description: https://www.digikey.com/product-detail/en/murata-electronics-north-america/GRM21BR61A476ME15L/490-9961-1-ND/5026442; ComponentLink1URL: https://www.digikey.com/product-detail/en/murata-electronics-north-america/GRM21BR61A476ME15L/490-9961-1-ND/5026442
D41 D42 = DIODE_SCHOTTKY_LOW_VF_40V_500MA_SOD323F: Manufacturer: Nexperia USA Inc.; Packaging: Cut Tape (CT); Part Status: Active; ComponentLink1URL: https://www.digikey.com/products/en/discrete-semiconductor-products/diodes-rectifiers-single/280?k=PMEG4005EJ%2C115&k=&pkeyword=PMEG4005EJ%2C115&pv7=2&sf=0&quantity=&ColumnSort=0&page=1&pageSize=25; ComponentLink1Description: https://www.digikey.com/products/en/discrete-semiconductor-products/diodes-rectifiers-single/280?k=PMEG4005EJ%2C115&k=&pkeyword=PMEG4005EJ%2C115&pv7=2&sf=0&quantity=&ColumnSort=0&page=1&pageSize=25; Supplier 1: Digi-Key; Supplier Part Number 1: 1727-3877-1-ND; Category: Discrete Semiconductor Products; Stock 1: 0; Pricing 1: 1=0.5, 10=0.38, 100=0.2414, 500=0.16946, 1000=0.1335 (USD)
F15 F16 = FILTER_0.1uF_16V_2A_NO_VIA_0603: as F5 on sheet 05_can_spi; Packaging: Cut Tape (CT); Part Status: Active; Tolerance: ±20%; Voltage - Rated: 16V; Operating Temperature: -55°C ~ 125°C; Supplier 1: Digi-Key; Supplier Part Number 1: 490-6969-1-ND; Category: Filters; Stock 1: 172860; Pricing 1: 1=0.19, 10=0.173, 25=0.1652, 50=0.1598, 100=0.1544, 250=0.1464, 500=0.12246, 1000=0.09503 (USD); ComponentLink1Description: https://www.digikey.com/products/en/filters/feed-through-capacitors/845?k=NFM18PC104R1C3D&k=&pkeyword=NFM18PC104R1C3D&pv7=2&sf=0&quantity=&ColumnSort=0&page=1&pageSize=25; ComponentLink1URL: https://www.digikey.com/products/en/filters/feed-through-capacitors/845?k=NFM18PC104R1C3D&k=&pkeyword=NFM18PC104R1C3D&pv7=2&sf=0&quantity=&ColumnSort=0&page=1&pageSize=25
F17 F18 = FUSE_PTC_250MA_SMD: Manufacturer: Bel Fuse Inc.; Type: Polymeric; Approvals: cURus, TUV; RoHS: RoHS Compliant; Packaging: Cut Tape (CT); Part Status: Active; Voltage - Max: 16V; Operating Temperature: -40°C ~ 85°C; Mounting Type: Surface Mount; Package / Case: 1206 (3216 Metric), Concave; Size / Dimension: 0.128" L x 0.065" W (3.25mm x 1.65mm); Thickness (Max): 0.047" (1.20mm); Supplier 1: Digi-Key; Supplier Part Number 1: 507-1798-1-ND; Category: Circuit Protection; Stock 1: 24334; Pricing 1: 1=0.21, 5=0.2, 10=0.191, 50=0.1706, 100=0.1588, 250=0.14112, 500=0.1176, 1000=0.11172 (USD); ComponentLink1Description: https://www.digikey.com/products/en/circuit-protection/ptc-resettable-fuses/150?k=ZCJ0025FF2E&k=&pkeyword=ZCJ0025FF2E&pv7=2&sf=0&quantity=&ColumnSort=0&page=1&pageSize=25; ComponentLink1URL: https://www.digikey.com/products/en/circuit-protection/ptc-resettable-fuses/150?k=ZCJ0025FF2E&k=&pkeyword=ZCJ0025FF2E&pv7=2&sf=0&quantity=&ColumnSort=0&page=1&pageSize=25
R76 R82 = RES_10K_1%_1/16W_0402: Manufacturer: Vishay Dale; Manufacturer Part Number: CRCW040210K0FKED; Packaging: Cut Tape (CT); Part Status: Active; Tolerance: ±1%; Operating Temperature: -55°C ~ 155°C; Supplier 1: Digi-Key; Supplier Part Number 1: 541-10.0KLCT-ND; Category: Resistors; Stock 1: 37996194; Pricing 1: 1=0.1, 10=0.014, 100=0.0056, 1000=0.00253, 2500=0.0022, 5000=0.00181 (USD); Power: 1/16W; ComponentLink1Description: https://www.digikey.com/products/en?keywords=311-10.0KLRCT-ND; ComponentLink1URL: https://www.digikey.com/products/en?keywords=311-10.0KLRCT-ND
R77-R80 R83-R85 = RES_47K_1%_1/16W_0402: Manufacturer: Yageo; Manufacturer Part Number: RC0402FR-0747KL; Packaging: Cut Tape (CT); Part Status: Active; Tolerance: ±1%; Operating Temperature: -55°C ~ 155°C; Supplier 1: Digi-Key; Supplier Part Number 1: 311-47.0KLRCT-ND; Category: Resistors; Stock 1: 959925; Pricing 1: 1=0.1, 10=0.014, 100=0.0056, 1000=0.00253, 2500=0.0022, 5000=0.00181 (USD); Power: 1/16W; ComponentLink1Description: https://www.digikey.com/product-detail/en/vishay-dale/CRCW040247K0FKEDC/541-3966-1-ND/7928649; ComponentLink1URL: https://www.digikey.com/product-detail/en/vishay-dale/CRCW040247K0FKEDC/541-3966-1-ND/7928649
R81 R86 = RES_16.9K_1%_1/16W_0402: Manufacturer: Yageo; Manufacturer Part Number: RC0402FR-0716K9L; Packaging: Cut Tape (CT); Part Status: Active; Tolerance: ±1%; Operating Temperature: -55°C ~ 155°C; Supplier 1: Digi-Key; Supplier Part Number 1: YAG3003CT-ND; Category: Resistors; Stock 1: 8493470; Pricing 1: 1=0.1, 10=0.014, 100=0.0056, 1000=0.00253, 2500=0.0022, 5000=0.00181 (USD); Power: 1/16W; ComponentLink1Description: https://www.digikey.com/product-detail/en/yageo/RC0402FR-0716K9L/YAG3003CT-ND/5281868; ComponentLink1URL: https://www.digikey.com/product-detail/en/yageo/RC0402FR-0716K9L/YAG3003CT-ND/5281868
U10 U12 = IC_MIC5332-SSYMT-TR: Manufacturer: Microchip Technology; Packaging: Cut Tape (CT); Part Status: Active; Operating Temperature: -40°C ~ 125°C; Supplier 1: Digi-Key; Supplier Part Number 1: 576-4110-1-ND; Category: Integrated Circuits (ICs); Stock 1: 9000; Pricing 1: 1=1, 25=0.8296, 100=0.756 (USD); ComponentLink2Description: https://www.digikey.com/product-detail/en/microchip-technology/MIC5332-SSYMT-TR/576-4110-1-ND/3671745; ComponentLink2URL: https://www.digikey.com/product-detail/en/microchip-technology/MIC5332-SSYMT-TR/576-4110-1-ND/3671745
U11 U13 = IC_BQ24315DSGT_8WSON: Manufacturer: Texas Instruments; Packaging: Cut Tape (CT); Part Status: Active; Operating Temperature: -40°C ~ 125°C (TJ); ComponentLink1URL: https://www.digikey.com/product-detail/en/texas-instruments/BQ24315DSGR/296-23341-1-ND/1833318; ComponentLink1Description: https://www.digikey.com/product-detail/en/texas-instruments/BQ24315DSGR/296-23341-1-ND/1833318; Supplier 1: Digi-Key; Supplier Part Number 1: 296-23341-1-ND; Category: Integrated Circuits (ICs); Stock 1: 9524; Pricing 1: 1=1.05, 10=0.936, 100=0.7297, 500=0.60276, 1000=0.47586 (USD)

## Sheet 09_servo.SchDoc: =Proj_Title
size B; Date: 05/11/2022; CheckedBy: David Sidrane; Author: Dugan Yoon; Organization: © 2022 NXP; Address1: Giesshuebelstrasse 40; Address2: 8045 Zurich, Switzerland; DocumentNumber: 725001; Revision: 01; SheetNumber: 9; SheetTotal: 11
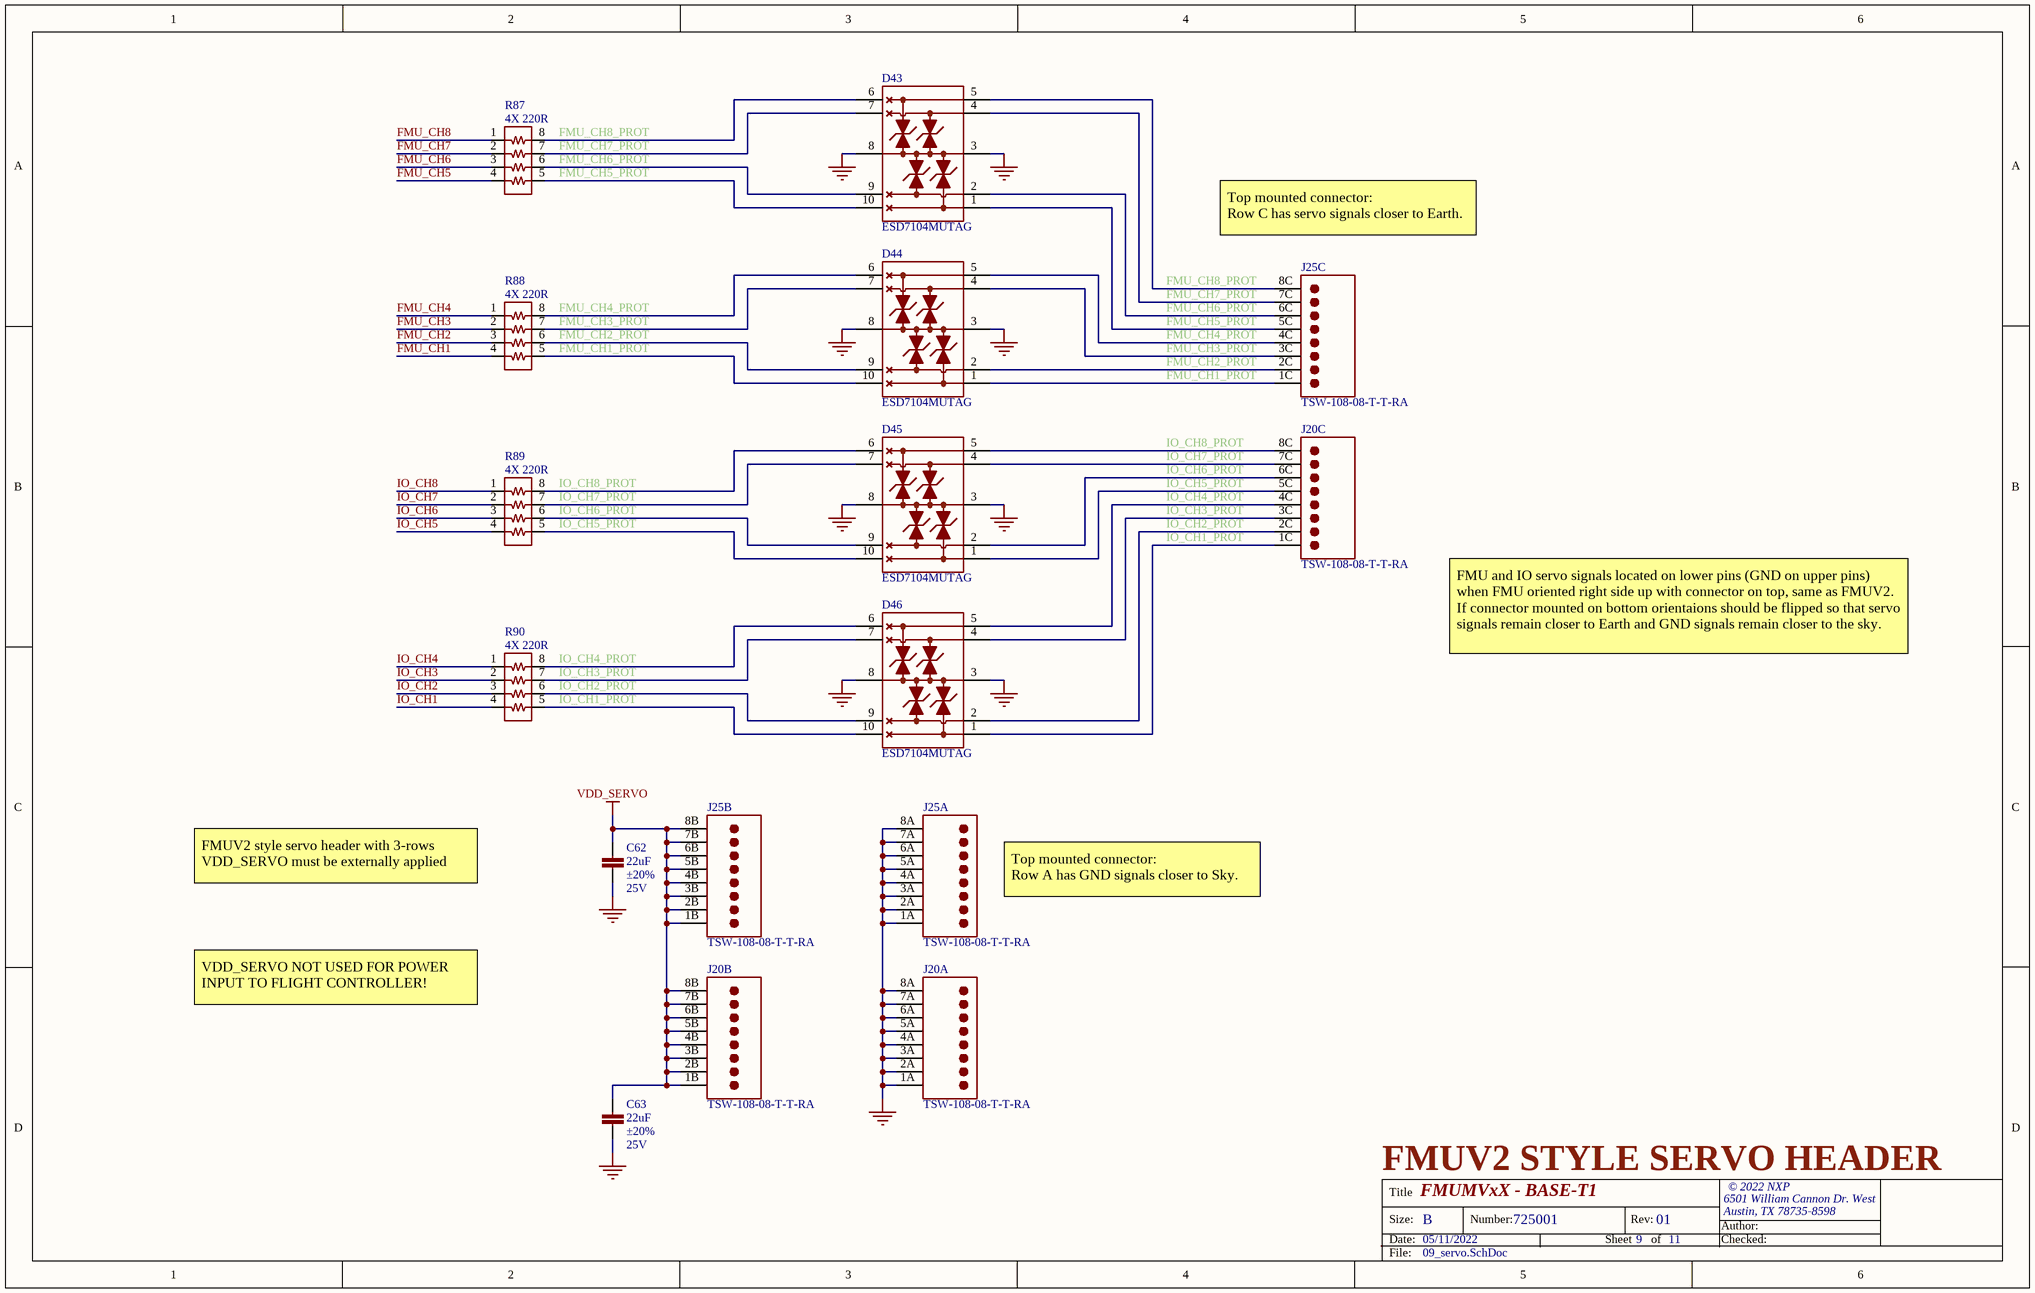
[diagram p5: 09_servo.SchDoc]

### Parts
C62  value 22uF  Tolerance: ±20%  Voltage - Rated: 25V  [CAPC200X125X70L40N]  (hidden comment: CAP CER 22UF 20% 25V X5R 0805)
C63  value 22uF  Tolerance: ±20%  Voltage - Rated: 25V  [CAPC200X125X70L40N]  (hidden comment: CAP CER 22UF 20% 25V X5R 0805)
D43  Manufacturer Part Number: ESD7104MUTAG  [UDFN10P50_250X100X55L35X20N]  (hidden comment: DIODE TVS BIDIRECTIONAL 5V 10V 10UDFN)
D44  Manufacturer Part Number: ESD7104MUTAG  [UDFN10P50_250X100X55L35X20N]  (hidden comment: DIODE TVS BIDIRECTIONAL 5V 10V 10UDFN)
D45  Manufacturer Part Number: ESD7104MUTAG  [UDFN10P50_250X100X55L35X20N]  (hidden comment: DIODE TVS BIDIRECTIONAL 5V 10V 10UDFN)
D46  Manufacturer Part Number: ESD7104MUTAG  [UDFN10P50_250X100X55L35X20N]  (hidden comment: DIODE TVS BIDIRECTIONAL 5V 10V 10UDFN)
J20  Manufacturer Part Number: TSW-108-08-T-T-RA  [3X8RA_ABC]  (hidden comment: CONN HDR 24POS 2.54MM RA TH)  (parts A,B,C of 3)
J25  Manufacturer Part Number: TSW-108-08-T-T-RA  [3X8RA_ABC]  (hidden comment: CONN HDR 24POS 2.54MM RA TH)  (parts A,B,C of 3)
R87  value 4X 220R  [RESCAF8P80_320X160X61L30X65N]  (hidden comment: RES ARRAY 4 RES 220 OHM 1206)
R88  value 4X 220R  [RESCAF8P80_320X160X61L30X65N]  (hidden comment: RES ARRAY 4 RES 220 OHM 1206)
R89  value 4X 220R  [RESCAF8P80_320X160X61L30X65N]  (hidden comment: RES ARRAY 4 RES 220 OHM 1206)
R90  value 4X 220R  [RESCAF8P80_320X160X61L30X65N]  (hidden comment: RES ARRAY 4 RES 220 OHM 1206)

### Nets
GND: C62.2 C63.2 D43.3(GND) D43.8(GND) D44.3(GND) D44.8(GND) D45.3(GND) D45.8(GND) D46.3(GND) D46.8(GND) J20.1A J20.2A J20.3A J20.4A J20.5A J20.6A J20.7A J20.8A J25.1A J25.2A J25.3A J25.4A J25.5A J25.6A J25.7A J25.8A
VDD_SERVO: C62.1 C63.1 J20.1B J20.2B J20.3B J20.4B J20.5B J20.6B J20.7B J20.8B J25.1B J25.2B J25.3B J25.4B J25.5B J25.6B J25.7B J25.8B
FMU_CH1: R88.4
FMU_CH1_PROT: D44.1 D44.10(NC) J25.1C R88.5
FMU_CH2: R88.3
FMU_CH2_PROT: D44.2 D44.9(NC) J25.2C R88.6
FMU_CH3: R88.2
FMU_CH3_PROT: D44.4 D44.7(NC) J25.3C R88.7
FMU_CH4: R88.1
FMU_CH4_PROT: D44.5 D44.6(NC) J25.4C R88.8
FMU_CH5: R87.4
FMU_CH5_PROT: D43.1 D43.10(NC) J25.5C R87.5
FMU_CH6: R87.3
FMU_CH6_PROT: D43.2 D43.9(NC) J25.6C R87.6
FMU_CH7: R87.2
FMU_CH7_PROT: D43.4 D43.7(NC) J25.7C R87.7
FMU_CH8: R87.1
FMU_CH8_PROT: D43.5 D43.6(NC) J25.8C R87.8
IO_CH1: R90.4
IO_CH1_PROT: D46.1 D46.10(NC) J20.1C R90.5
IO_CH2: R90.3
IO_CH2_PROT: D46.2 D46.9(NC) J20.2C R90.6
IO_CH3: R90.2
IO_CH3_PROT: D46.4 D46.7(NC) J20.3C R90.7
IO_CH4: R90.1
IO_CH4_PROT: D46.5 D46.6(NC) J20.4C R90.8
IO_CH5: R89.4
IO_CH5_PROT: D45.1 D45.10(NC) J20.5C R89.5
IO_CH6: R89.3
IO_CH6_PROT: D45.2 D45.9(NC) J20.6C R89.6
IO_CH7: R89.2
IO_CH7_PROT: D45.4 D45.7(NC) J20.7C R89.7
IO_CH8: R89.1
IO_CH8_PROT: D45.5 D45.6(NC) J20.8C R89.8

### Notes on the sheet
- Top mounted connector:
  Row C has servo signals closer to Earth.
- FMU and IO servo signals located on lower pins (GND on upper pins) when FMU oriented right side up with connector on top, same as FMUV2. If connector mounted on bottom orientaions should be flipped so that servo signals remain closer to Earth and GND signals remain closer to the sky.
- FMUV2 style servo header with 3-rows
  VDD_SERVO must be externally applied
- Top mounted connector:
  Row A has GND signals closer to Sky.
- VDD_SERVO NOT USED FOR POWER INPUT TO FLIGHT CONTROLLER!
- FMUV2 STYLE SERVO HEADER
- Title
- Size:
- Date:
- B
- Number:
- Sheet
- Rev:
- of
- Author:
- Checked:
- File:

### Library data of the parts
C62 C63 = CAP_22UF_20%_25V_X5R_0805: as C46 on sheet 08_power; Packaging: Cut Tape (CT); Part Status: Active; Operating Temperature: -55°C ~ 125°C; Supplier 1: Digi-Key; Supplier Part Number 1: 490-12389-1-ND; Category: Capacitors; Stock 1: 0; Pricing 1: 1=0.58 (USD); ComponentLink1Description: https://www.digikey.com/en/products/detail/murata-electronics/GRT21BR61E226ME13L/5416811; ComponentLink1URL: https://www.digikey.com/en/products/detail/murata-electronics/GRT21BR61E226ME13L/5416811
D43-D46 = DIODE_TVS_4X_10UDFN: Manufacturer: ON Semiconductor; Packaging: Cut Tape (CT); Part Status: Active; Operating Temperature: -55°C ~ 125°C (TJ); Supplier 1: Digi-Key; Supplier Part Number 1: ESD7104MUTAGOSCT-ND; Category: Circuit Protection; Stock 1: 5750; Pricing 1: 1=0.63, 10=0.541, 100=0.40370, 500=0.31716, 1000=0.24508 (USD); ComponentLink1Description: https://www.digikey.com/product-detail/en/on-semiconductor/ESD7104MUTAG/ESD7104MUTAGOSCT-ND/3487538; ComponentLink1URL: https://www.digikey.com/product-detail/en/on-semiconductor/ESD7104MUTAG/ESD7104MUTAGOSCT-ND/3487538
J20 J25 = CONN_HDR_3X8RA_TH: Manufacturer: Samtec; System: Connector; Category: Connectors, Interconnects; Operating Temperature: -55°C ~ 125°C; Packaging: Bulk; Voltage - Rated: -; Part Status: Active; Supplier Part Number 1: TSW-108-08-T-T-RA-ND; Supplier 1: Digi-Key; Stock 1: 302; Pricing 1: 1=1.53 (USD); ComponentLink1Description: https://www.digikey.com/product-detail/en/samtec-inc/TSW-108-08-T-T-RA/TSW-108-08-T-T-RA-ND/7869165; ComponentLink1URL: https://www.digikey.com/product-detail/en/samtec-inc/TSW-108-08-T-T-RA/TSW-108-08-T-T-RA-ND/7869165
R87-R90 = RES_ARRAY_220_5%_1/16W_1206: Manufacturer: Yageo; Manufacturer Part Number: YC164-JR-07220RL; Tolerance: ±5%; Power: 1/16W; Packaging: Cut Tape (CT); Part Status: Active; Operating Temperature: -55°C ~ 155°C; Supplier 1: Digi-Key; Supplier Part Number 1: YC164J-220CT-ND; Category: Resistors; Stock 1: 17927; Pricing 1: 1=0.1, 10=0.014, 100=0.0056, 1000=0.00253, 2500=0.0022, 5000=0.00181 (USD); ComponentLink1Description: https://www.digikey.com/products/en/resistors/resistor-networks-arrays/50?k=&pkeyword=&pv16=9574&sf=0&FV=fffc000d%2C1c0002%2C1f140000%2C24280001%2Cffe00032%2C40136&quantity=&ColumnSort=0&page=1&pageSize=25; ComponentLink1URL: https://www.digikey.com/products/en/resistors/resistor-networks-arrays/50?k=&pkeyword=&pv16=9574&sf=0&FV=fffc000d%2C1c0002%2C1f140000%2C24280001%2Cffe00032%2C40136&quantity=&ColumnSort=0&page=1&pageSize=25